# Altium schematic sheet DAC_12bit.SchDoc
size A4; ApprovedBy: Mateusz Kowalik; CheckedBy: Mateusz Kowalik; Author: Mateusz Kowalik; CompanyName: InMotion Labs sp. z o.o.; DrawnBy: Mateusz Kowalik; Engineer: Mateusz Kowalik; Organization: InMotion Labs sp. z o.o.; Address1: Rydlówka 5A; Address2: 30-363 Kraków; Address4: Poland; DocumentNumber: 3; Revision: Rev 0; SheetNumber: 10; SheetTotal: 17
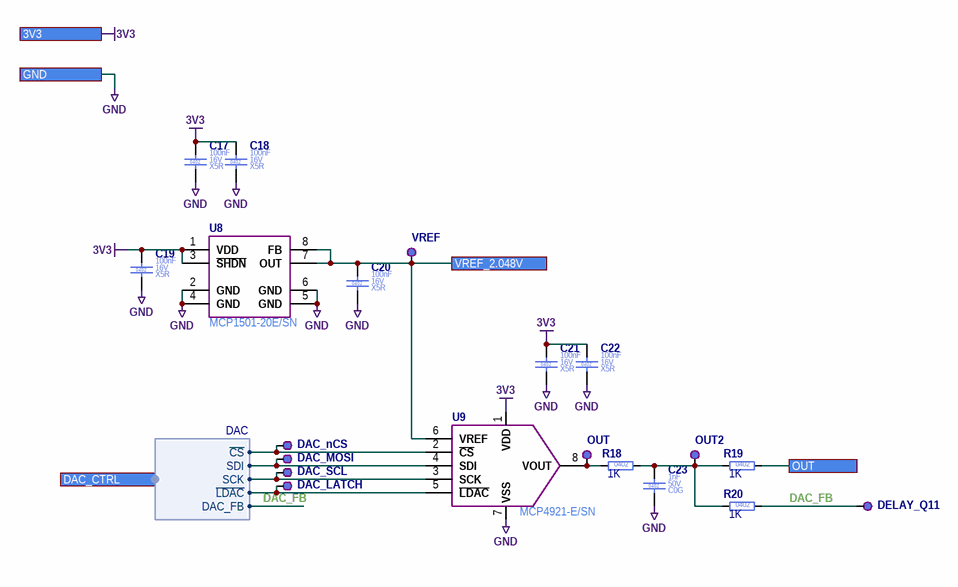
[diagram p0: DAC_12bit.SchDoc]

## Parts
C17  Case/Package: 0402  Voltage Rating (DC): 16V  Dielectric: X5R  Capacitance: 100nF  [C_0402_1005]  (hidden comment: C_100NF_16V_X5R_0402_10)
C18  Case/Package: 0402  Voltage Rating (DC): 16V  Dielectric: X5R  Capacitance: 100nF  [C_0402_1005]  (hidden comment: C_100NF_16V_X5R_0402_10)
C19  Case/Package: 0402  Voltage Rating (DC): 16V  Dielectric: X5R  Capacitance: 100nF  [C_0402_1005]  (hidden comment: C_100NF_16V_X5R_0402_10)
C20  Case/Package: 0402  Voltage Rating (DC): 16V  Dielectric: X5R  Capacitance: 100nF  [C_0402_1005]  (hidden comment: C_100NF_16V_X5R_0402_10)
C21  Case/Package: 0402  Voltage Rating (DC): 16V  Dielectric: X5R  Capacitance: 100nF  [C_0402_1005]  (hidden comment: C_100NF_16V_X5R_0402_10)
C22  Case/Package: 0402  Voltage Rating (DC): 16V  Dielectric: X5R  Capacitance: 100nF  [C_0402_1005]  (hidden comment: C_100NF_16V_X5R_0402_10)
C23  Case/Package: 0402  Voltage Rating (DC): 50V  Dielectric: C0G  Capacitance: 1nF  [C_0402_1005]  (hidden comment: C_1NF_50V_C0G_0402_5)
DAC_LATCH  TP_PAD_1.3MM  [TP_PAD_1.3MM]  (value not drawn)  (no BOM)
DAC_MOSI  TP_PAD_1.3MM  [TP_PAD_1.3MM]  (value not drawn)  (no BOM)
DAC_nCS  TP_PAD_1.3MM  [TP_PAD_1.3MM]  (value not drawn)  (no BOM)
DAC_SCL  TP_PAD_1.3MM  [TP_PAD_1.3MM]  (value not drawn)  (no BOM)
DELAY_Q11  TP_PAD_1.3MM  [TP_PAD_1.3MM]  (value not drawn)  (no BOM)
OUT  TP_PAD_1.3MM  [TP_PAD_1.3MM]  (value not drawn)  (no BOM)
OUT2  TP_PAD_1.3MM  [TP_PAD_1.3MM]  (value not drawn)  (no BOM)
R18  Resistance: 1K  Case/Package: 0402  [R_0402_1005]  (hidden comment: R_1K_0402_1)
R19  Resistance: 1K  Case/Package: 0402  [R_0402_1005]  (hidden comment: R_1K_0402_1)
R20  Resistance: 1K  Case/Package: 0402  [R_0402_1005]  (hidden comment: R_1K_0402_1)
U8  Manufacturer Part Number: MCP1501-20E/SN  [SOIC127P600X170-8N]  (hidden comment: MCP1501_SOIC)
U9  MCP4921-E/SN  [SOIC127P600X170-8N]
VREF  TP_PAD_1.3MM  [TP_PAD_1.3MM]  (value not drawn)  (no BOM)

## Ports
3V3, DAC_CTRL (harness DAC), GND, OUT, VREF_2.048V

## Harnesses
DAC: ~{CS}, SDI, SCK, ~{LDAC}, DAC_FB

## Nets
3V3: C17.1 C18.1 C19.1 C21.1 C22.1 U8.1(VDD) U8.3(~{SHDN}) U9.1(VDD) ; port 3V3
GND: C17.2 C18.2 C19.2 C20.2 C21.2 C22.2 C23.2 U8.2(GND) U8.4(GND) U8.5(GND) U8.6(GND) U9.7(VSS) ; port GND
DAC_FB: DELAY_Q11.1(TP) R20.2 ; port DAC_CTRL.DAC_FB
OUT: R19.2 ; port OUT
VREF_2.048V: C20.1 U8.7(OUT) U8.8(FB) U9.6(VREF) VREF.1(TP) ; port VREF_2.048V
NetC23_1: C23.1 OUT2.1(TP) R18.2 R19.1 R20.1
NetDAC_LATCH_1: DAC_LATCH.1(TP) U9.5(~{LDAC}) ; port DAC_CTRL.~{LDAC}
NetDAC_MOSI_1: DAC_MOSI.1(TP) U9.4(SDI) ; port DAC_CTRL.SDI
NetDAC_nCS_1: DAC_nCS.1(TP) U9.2(~{CS}) ; port DAC_CTRL.~{CS}
NetDAC_SCL_1: DAC_SCL.1(TP) U9.3(SCK) ; port DAC_CTRL.SCK
NetOUT_1: OUT.1(TP) R18.1 U9.8(VOUT)

## Notes on the sheet
- Title
- Size:
- Date:
- A4

## Library data of the parts
C17-C22 = C_100NF_16V_X5R_0402_10: Ceramic Capacitor; Manufacturer Part Number: EMK105BJ104KV-F; Manufacturer: Taiyo Yuden; Value: 100nF; Tolerance: 10%; Part Number: C_100NF_16V_X5R_0402_10; Mount: Surface Mount; Height: 500um; HelpURL: http://datasheet.octopart.com/EMK105BJ104KV-F-Taiyo-Yuden-datasheet-8857305.pdf; RoHS: Compliant; Max Operating Temperature: 125°C; Status: MK; Supplier 1: Mouser; Supplier Part Number 1: 963-EMK105BJ104KV-F; Manufacturer 2: Samsung Electro-Mechanics; Manufacturer Part Number 2: CL05B104KO5NNNC; Supplier 2: LCSC; Supplier Part Number 2: C1525
C23 = C_1NF_50V_C0G_0402_5: Ceramic Capacitor; Manufacturer Part Number: UMK105CG102JV-F; Manufacturer: Taiyo Yuden; Value: 1nF; Tolerance: 5%; Part Number: C_1NF_50V_C0G_0402_5; Mount: Surface Mount; Height: 500um; HelpURL: https://pl.mouser.com/datasheet/2/396/mlcc02_e-1307760.pdf; RoHS: Compliant; Max Operating Temperature: 125°C; Status: AK; Supplier 1: Mouser; Supplier Part Number 1: 963-JMK212ABJ106KG-T; Manufacturer 2: Guangdong Fenghua Advanced Tech; Manufacturer Part Number 2: 0402B102K500NT; Supplier 2: LCSC; Supplier Part Number 2: C1523
DAC_LATCH DAC_MOSI DAC_nCS DAC_SCL DELAY_Q11 OUT OUT2 VREF = TP_PAD_1.3MM: Testpoint SMD 1.3mm; Part Number: TP_PAD_1.3MM; Case/Package: SMD; Length: 0mm
R18-R20 = R_1K_0402_1: Thick Film Resistor; Manufacturer: Yageo; Manufacturer Part Number: RC0402FR-7D1KL; Value: 1K; Tolerance: 1%; Voltage Rating (DC): 50V; Power Rating: 63mW; Stats: MK; Part Number: R_1K_0402_1; Mount: Surface Mount; Height: 350um; HelpURL: https://pl.mouser.com/datasheet/2/447/PYu-RC_Group_51_RoHS_L_10-1664068.pdf; RoHS: Compliant; Max Operating Temperature: 155°C; Supplier 1: Mouser; Supplier Part Number 1: 603-RC0402FR-7D1KL; Manufacturer 2: Uniroyal Elec; Manufacturer Part Number 2: 0402WGF1001TCE; Supplier 2: LCSC; Supplier Part Number 2: C11702
U8 = MCP1501-20E/SN: 2.048V Voltage References Precision Buffered Voltage Reference; Manufacturer: Microchip Technology; Tolerance: 0.1; Output Current: 20mA; Max Input Voltage: 5.5V; Output Type: Fixed; Reference Type: Series; Part Number: MCP1501-20E/SN; Case/Package: SOIC8; Max Output Current: 20mA; Max Output Voltage: 2.048V; Max Operating Temperature: 125°C; Min Output Voltage: 2.048V; Min Operating Temperature: -40°C; Mount: Surface Mount; Height: 1.45mm; HelpURL: https://pl.mouser.com/datasheet/2/268/20005474C-961722.pdf; Lead Free: Lead Free; Length: 2.9mm; Number of Pins: 6; Output Voltage: 2.048V; REACH SVHC: No SVHC; Reference Voltage: 2.048V; RoHS: Compliant; Width: 1.55mm; Status: MK; Supplier 1: Mouser; Supplier Part Number 1: 579-MCP1501-20E/SN
U9 = MCP4921-E/SN: 1 Channel DAC 12 bit; Manufacturer: Microchip; Polarity: Unipolar; Interface: SPI; Max Supply Voltage: 5.5; Min Supply Voltage: 2.7; Resolution: 12bit; Sampling Rate: 450kHz; Part Number: MCP4921-E/SN; Manufacturer Part Number: MCP4921-E/SN; Case/Package: SO8; Mount: Surface Mount; Height: 1.75mm; HelpURL: https://ww1.microchip.com/downloads/en/DeviceDoc/22248a.pdf; Max Operating Temperature: 125; RoHS: Compliant; Status: MK; Supplier 1: Mouser; Supplier Part Number 1: 579-MCP4921-E/SN